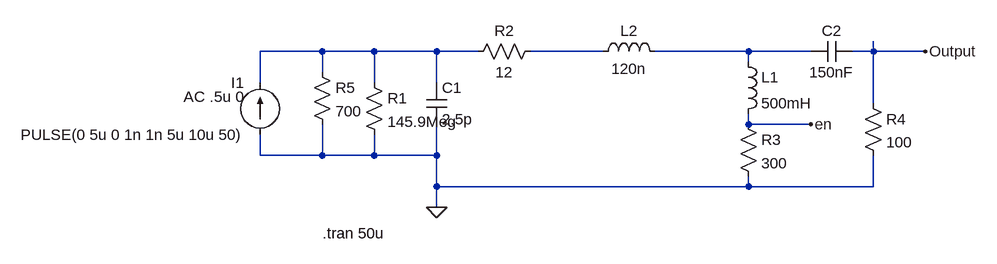
[diagram p0: schematic AC DC separator with inductor.asc]
AC DC separator with inductor.asc, the LTspice schematic file:
Version 4
SHEET 1 1228 680
WIRE 48 256 -48 256
WIRE 128 256 48 256
WIRE 224 256 128 256
WIRE 288 256 224 256
WIRE 480 256 368 256
WIRE 704 256 560 256
WIRE 800 256 704 256
WIRE 896 256 896 240
WIRE 896 256 864 256
WIRE 976 256 896 256
WIRE 704 272 704 256
WIRE 48 288 48 256
WIRE -48 304 -48 256
WIRE 128 304 128 256
WIRE 224 304 224 256
WIRE 896 336 896 256
WIRE 704 368 704 352
WIRE 800 368 704 368
WIRE -48 416 -48 384
WIRE 48 416 48 368
WIRE 48 416 -48 416
WIRE 128 416 128 384
WIRE 128 416 48 416
WIRE 224 416 224 368
WIRE 224 416 128 416
WIRE 224 464 224 416
WIRE 704 464 704 448
WIRE 704 464 224 464
WIRE 896 464 896 416
WIRE 896 464 704 464
WIRE 224 496 224 464
FLAG 224 496 0
FLAG 976 256 Output
FLAG 800 368 en
SYMBOL res 112 288 R0
SYMATTR InstName R1
SYMATTR Value 145.9Meg
SYMBOL cap 208 304 R0
SYMATTR InstName C1
SYMATTR Value 2.5p
SYMBOL res 384 240 R90
WINDOW 0 0 56 VBottom 2
WINDOW 3 32 56 VTop 2
SYMATTR InstName R2
SYMATTR Value 12
SYMBOL current -48 384 R180
WINDOW 3 24 0 Left 2
WINDOW 0 24 80 Left 2
WINDOW 123 24 58 Left 2
SYMATTR Value PULSE(0 5u 0 1n 1n 5u 10u 50)
SYMATTR InstName I1
SYMATTR Value2 AC .5u 0
SYMBOL Cap 864 240 R90
WINDOW 0 0 32 VBottom 2
WINDOW 3 32 32 VTop 2
SYMATTR InstName C2
SYMATTR Value 150nF
SYMBOL ind 464 272 R270
WINDOW 0 32 56 VTop 2
WINDOW 3 5 56 VBottom 2
SYMATTR InstName L2
SYMATTR Value 120n
SYMBOL Res 880 320 R0
SYMATTR InstName R4
SYMATTR Value 100
SYMBOL res 32 272 R0
SYMATTR InstName R5
SYMATTR Value 700
SYMBOL ind 688 256 R0
SYMATTR InstName L1
SYMATTR Value 500mH
SYMBOL Res 688 352 R0
SYMATTR InstName R3
SYMATTR Value 300
TEXT 48 536 Left 2 !.tran 50u

The netlist it stands for:
* AC DC separator with inductor.asc
R1 N001 0 145.9Meg
C1 N001 0 2.5p
R2 N002 N001 12
I1 0 N001 PULSE(0 5u 0 1n 1n 5u 10u 50) AC .5u 0
C2 Output N003 150nF
L2 N002 N003 120n
R4 Output 0 100
R5 N001 0 700
L1 N003 en 500mH
R3 en 0 300
.tran 50u
.backanno
.end